# Altium project LV-PCB.PrjPCB
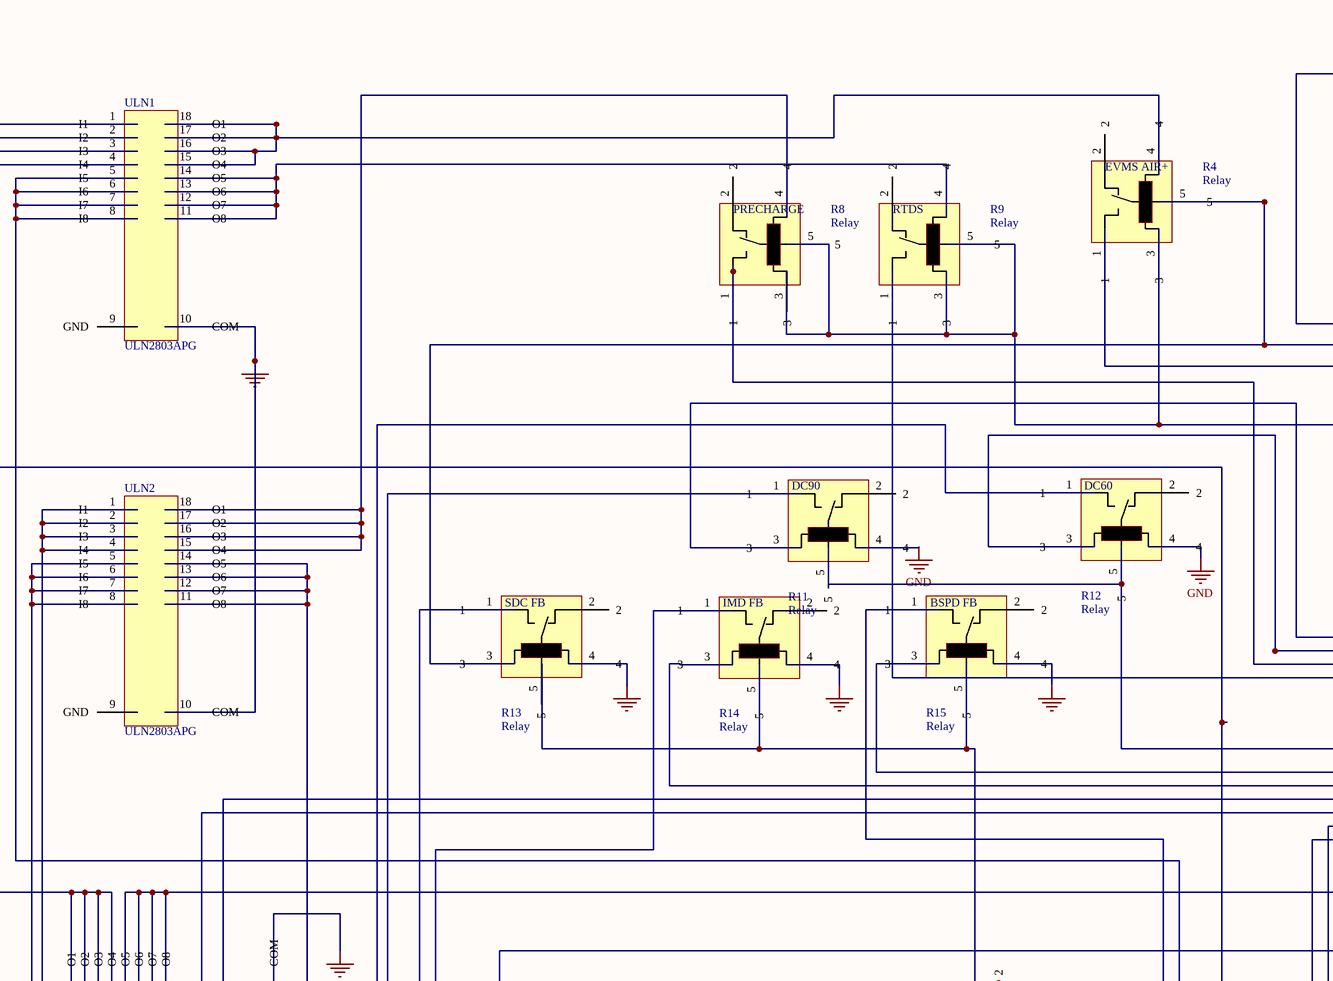
[diagram p0: Main.SchDoc, top left]
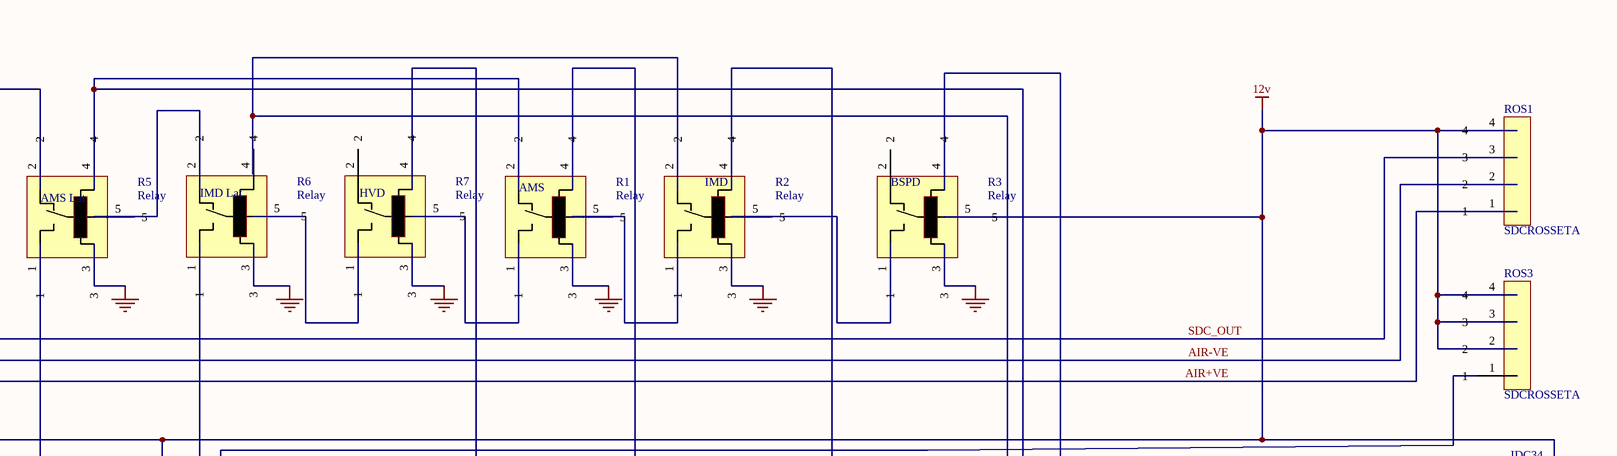
[diagram p1: Main.SchDoc, top right]
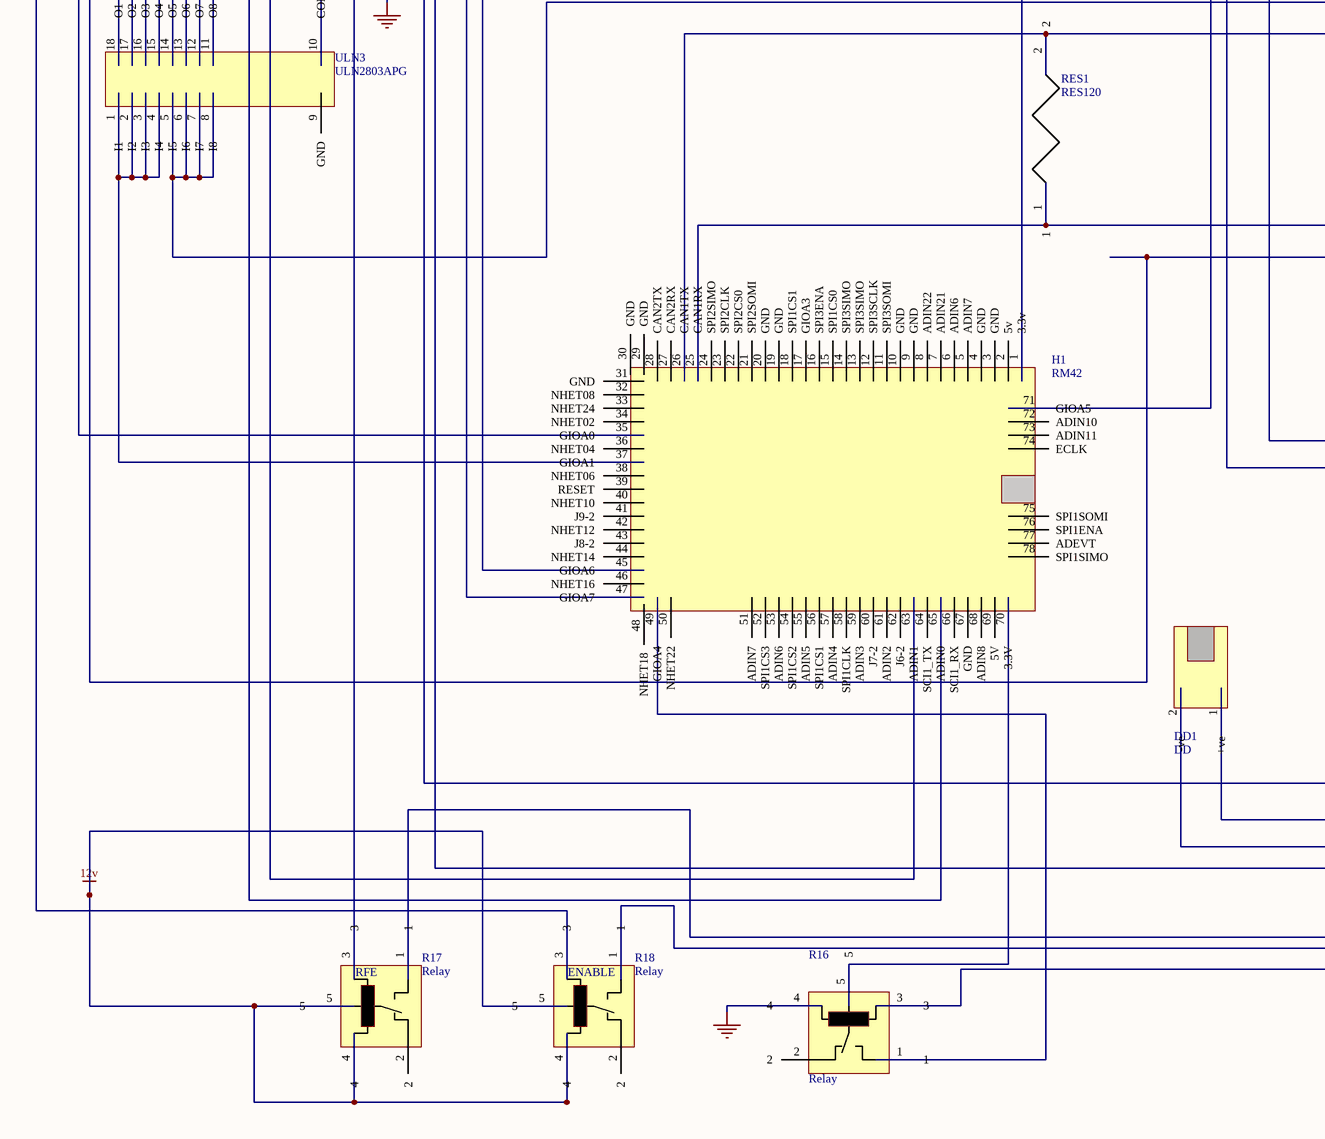
[diagram p2: Main.SchDoc, bottom left]
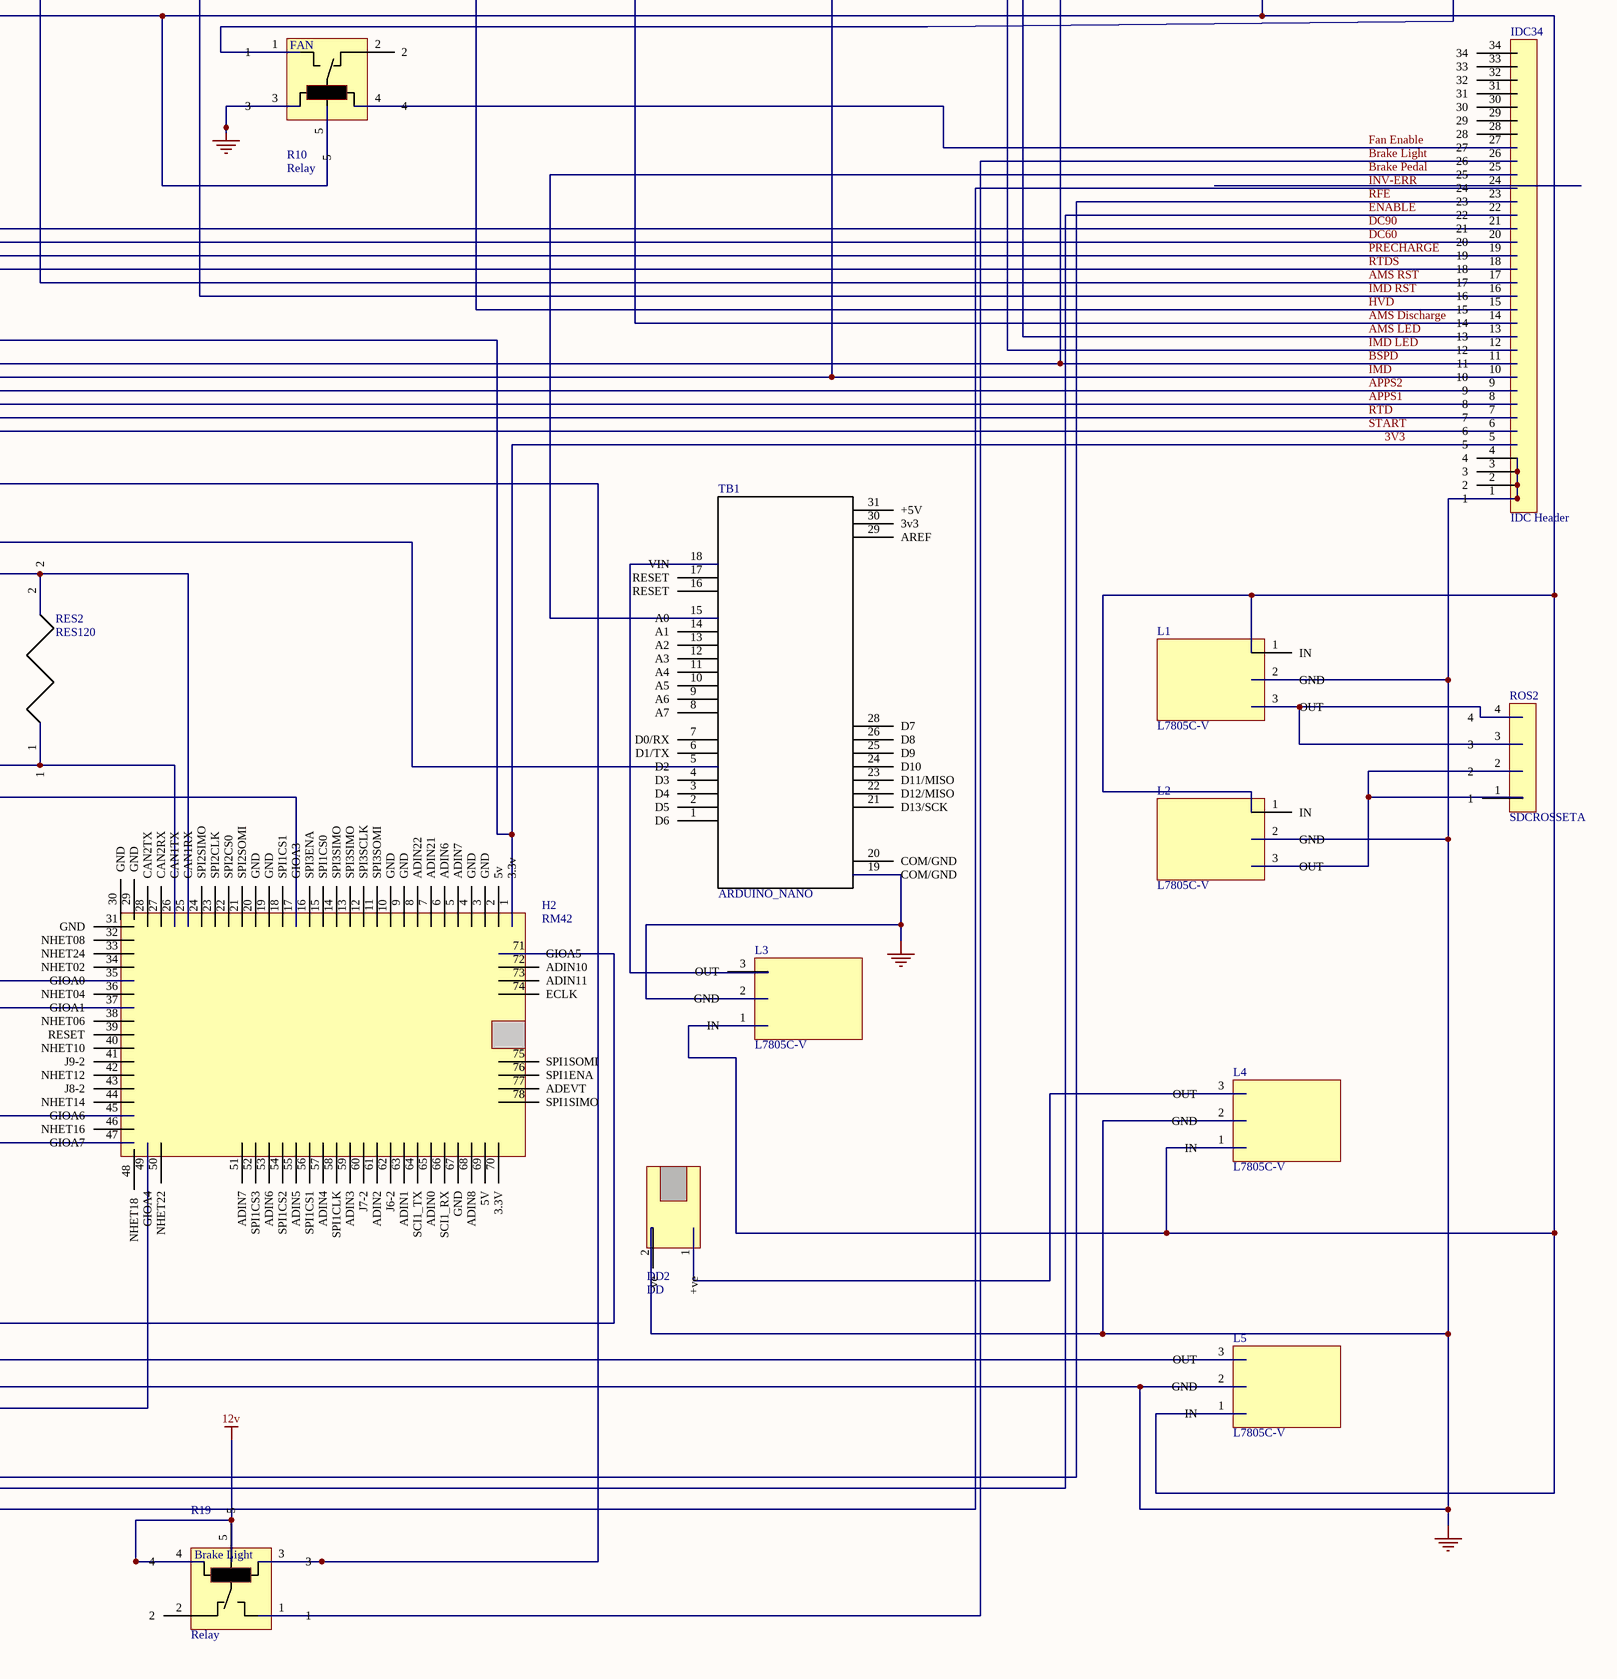
[diagram p3: Main.SchDoc, bottom right]
1 sheet, 38 parts. Net scope: global (net labels, ports and power ports of the same name join across sheets).
Board file: Main.PcbDoc

## Sheet Main.SchDoc
size A2

### Parts
DD1  DD  [DCDCBoost]
DD2  DD  [DCDCBoost]
H1  RM42  [Hercules]
H2  RM42  [Hercules]
IDC34  IDC Header  [IDC34]
L1  L7805C-V  [L7805C-P]
L2  L7805C-V  [L7805C-P]
L3  L7805C-V  [L7805C-P]
L4  L7805C-V  [L7805C-P]
L5  L7805C-V  [L7805C-P]
R1  Relay  [RelayARP03F]
R2  Relay  [RelayARP03F]
R3  Relay  [RelayARP03F]
R4  Relay  [RelayARP03F]
R5  Relay  [RelayARP03F]
R6  Relay  [RelayARP03F]
R7  Relay  [RelayARP03F]
R8  Relay  [RelayARP03F]
R9  Relay  [RelayARP03F]
R10  Relay  [RelayARP03F]
R11  Relay  [RelayARP03F]
R12  Relay  [RelayARP03F]
R13  Relay  [RelayARP03F]
R14  Relay  [RelayARP03F]
R15  Relay  [RelayARP03F]
R16  Relay  [RelayARP03F]
R17  Relay  [RelayARP03F]
R18  Relay  [RelayARP03F]
R19  Relay  [RelayARP03F]
RES1  RES120  [RES120]
RES2  RES120  [RES120]
ROS1  SDCROSSETA  [ROSSETA]
ROS2  SDCROSSETA  [ROSSETA]
ROS3  SDCROSSETA  [ROSSETA]
TB1  ARDUINO_NANO  [SHIELD_ARDUINO_NANO]
ULN1  ULN2803APG  [ULN2803APG]
ULN2  ULN2803APG  [ULN2803APG]
ULN3  ULN2803APG  [ULN2803APG]

### Nets
12v: L1.1(IN) L2.1(IN) L3.1(IN) L4.1(IN) L5.1(IN) R3.5 R4.3 R8.3 R8.5 R9.3 R9.5 R10.5 R17.4 R17.5 R18.4 R18.5 R19.4 R19.5 ROS1.4 ROS3.2 ROS3.3 ROS3.4
GND: DD1.2(-ve) DD2.2(-ve) IDC34.1 IDC34.2 IDC34.3 IDC34.4 L1.2(GND) L2.2(GND) L3.2(GND) L4.2(GND) L5.2(GND) R1.3 R2.3 R3.3 R5.3 R6.3 R7.3 R10.3 R11.4 R12.4 R13.4 R14.4 R15.4 R16.4 TB1.19(COM/GND) ULN1.10(COM) ULN2.10(COM) ULN3.10(COM)
3V3: H2.1(3.3v) IDC34.5 R11.5 R12.5
AIR+VE: R4.1 ROS1.1
AIR-VE: R4.5 R13.3 ROS1.2
AMS Discharge: IDC34.14 R1.4
AMS LED: IDC34.13 R1.2 R5.4
AMS RST: IDC34.17 R5.1
APPS1: H1.65(ADIN0) IDC34.8
APPS2: H1.63(ADIN1) IDC34.9
Brake Light: IDC34.26 R19.1
Brake Pedal: IDC34.25 TB1.15(A0)
BSPD: IDC34.11 R3.4 R15.3
DC60: IDC34.20 R12.3
DC90: IDC34.21 R11.3
ENABLE: IDC34.22 R18.1
Fan Enable: IDC34.27 R10.4
HVD: IDC34.15 R7.4
IMD: IDC34.10 R2.4 R14.3
IMD LED: IDC34.12 R2.2
IMD RST: IDC34.16 R6.1
INV-ERR: IDC34.24 R16.3
PRECHARGE: IDC34.19 R8.1
RFE: IDC34.23 R17.1
RTD: H2.47(GIOA7) IDC34.7
RTDS: IDC34.18 R9.1
SDC_OUT: R5.2 ROS1.3
START: H2.45(GIOA6) IDC34.6
NetDD1_1: DD1.1(+ve) L5.3(OUT)
NetDD2_1: DD2.1(+ve) L4.3(OUT)
NetH1_1: H1.1(3.3v) R13.5 R14.5 R15.5
NetH1_25: H1.25(CAN1RX) H2.26(CAN1TX) RES1.1 RES2.1
NetH1_26: H1.26(CAN1TX) H2.25(CAN1RX) RES1.2 RES2.2
NetH1_35: H1.35(GIOA0) ULN2.5(I5) ULN2.6(I6) ULN2.7(I7) ULN2.8(I8)
NetH1_37: H1.37(GIOA1) ULN3.1(I1) ULN3.2(I2) ULN3.3(I3) ULN3.4(I4)
NetH1_45: H1.45(GIOA6) R14.1
NetH1_47: H1.47(GIOA7) R13.1
NetH1_49: H1.49(GIOA4) R16.1
NetH1_70: H1.70(3.3V) R16.5
NetH1_71: H1.71(GIOA5) R15.1
NetH2_17: H2.17(GIOA3) ULN2.1(I1) ULN2.2(I2) ULN2.3(I3) ULN2.4(I4)
NetH2_35: H2.35(GIOA0) ULN1.1(I1) ULN1.2(I2) ULN1.3(I3) ULN1.4(I4)
NetH2_37: H2.37(GIOA1) ULN1.5(I5) ULN1.6(I6) ULN1.7(I7) ULN1.8(I8)
NetH2_49: H2.49(GIOA4) R11.1
NetH2_71: H2.71(GIOA5) R12.1
NetL1_3: L1.3(OUT) ROS2.3 ROS2.4
NetL2_3: L2.3(OUT) ROS2.1 ROS2.2
NetL3_3: L3.3(OUT) TB1.18(VIN)
NetR1_1: R1.1 R7.5
NetR1_5: R1.5 R2.1
NetR2_5: R2.5 R3.1
NetR4_4: R4.4 ULN1.15(O4) ULN1.16(O3) ULN1.17(O2) ULN1.18(O1)
NetR5_5: R5.5 R6.2
NetR6_5: R6.5 R7.1
NetR8_4: R8.4 ULN2.15(O4) ULN2.16(O3) ULN2.17(O2) ULN2.18(O1)
NetR9_4: R9.4 ULN1.11(O8) ULN1.12(O7) ULN1.13(O6) ULN1.14(O5)
NetR10_1: R10.1 ROS3.1
NetR17_3: R17.3 ULN2.11(O8) ULN2.12(O7) ULN2.13(O6) ULN2.14(O5)
NetR18_3: R18.3 ULN3.15(O4) ULN3.16(O3) ULN3.17(O2) ULN3.18(O1)
NetR19_3: R19.3 ULN3.11(O8) ULN3.12(O7) ULN3.13(O6) ULN3.14(O5)
NetTB1_5: TB1.5(D2) ULN3.5(I5) ULN3.6(I6) ULN3.7(I7) ULN3.8(I8)

Not connected (* = marked no-connect by the designer): H1 2(5v) 3(GND) 4(GND) 5(ADIN7) 6(ADIN6) 7(ADIN21) 8(ADIN22) 9(GND) 10(GND) 11(SPI3SOMI) 12(SPI3SCLK) 13(SPI3SIMO) 14(SPI3SIMO) 15(SPI1CS0) 16(SPI3ENA) 17(GIOA3) 18(SPI1CS1) 19(GND) 20(GND) 21(SPI2SOMI) 22(SPI2CS0) 23(SPI2CLK) 24(SPI2SIMO) 27(CAN2RX) 28(CAN2TX) 29(GND) 30(GND) 31(GND) 32(NHET08) 33(NHET24) 34(NHET02) 36(NHET04) 38(NHET06) 39(RESET) 40(NHET10) 41(J9-2) 42(NHET12) 43(J8-2) 44(NHET14) 46(NHET16) 48(NHET18) 50(NHET22) 51(ADIN7) 52(SPI1CS3) 53(ADIN6) 54(SPI1CS2) 55(ADIN5) 56(SPI1CS1) 57(ADIN4) 58(SPI1CLK) 59(ADIN3) 60(J7-2) 61(ADIN2) 62(J6-2) 64(SCI1_TX) 66(SCI1_RX) 67(GND) 68(ADIN8) 69(5V) 72(ADIN10) 73(ADIN11) 74(ECLK) 75(SPI1SOMI) 76(SPI1ENA) 77(ADEVT) 78(SPI1SIMO); H2 2(5v) 3(GND) 4(GND) 5(ADIN7) 6(ADIN6) 7(ADIN21) 8(ADIN22) 9(GND) 10(GND) 11(SPI3SOMI) 12(SPI3SCLK) 13(SPI3SIMO) 14(SPI3SIMO) 15(SPI1CS0) 16(SPI3ENA) 18(SPI1CS1) 19(GND) 20(GND) 21(SPI2SOMI) 22(SPI2CS0) 23(SPI2CLK) 24(SPI2SIMO) 27(CAN2RX) 28(CAN2TX) 29(GND) 30(GND) 31(GND) 32(NHET08) 33(NHET24) 34(NHET02) 36(NHET04) 38(NHET06) 39(RESET) 40(NHET10) 41(J9-2) 42(NHET12) 43(J8-2) 44(NHET14) 46(NHET16) 48(NHET18) 50(NHET22) 51(ADIN7) 52(SPI1CS3) 53(ADIN6) 54(SPI1CS2) 55(ADIN5) 56(SPI1CS1) 57(ADIN4) 58(SPI1CLK) 59(ADIN3) 60(J7-2) 61(ADIN2) 62(J6-2) 63(ADIN1) 64(SCI1_TX) 65(ADIN0) 66(SCI1_RX) 67(GND) 68(ADIN8) 69(5V) 70(3.3V) 72(ADIN10) 73(ADIN11) 74(ECLK) 75(SPI1SOMI) 76(SPI1ENA) 77(ADEVT) 78(SPI1SIMO); IDC34 28 29 30 31 32 33 34; R3 2; R4 2; R6 4; R7 2; R8 2; R9 2; R10 2; R11 2; R12 2; R13 2; R14 2; R15 2; R16 2; R17 2; R18 2; R19 2; TB1 1(D6) 2(D5) 3(D4) 4(D3) 6(D1/TX) 7(D0/RX) 8(A7) 9(A6) 10(A5) 11(A4) 12(A3) 13(A2) 14(A1) 16(RESET) 17(RESET) 20(COM/GND) 21(D13/SCK) 22(D12/MISO) 23(D11/MISO) 24(D10) 25(D9) 26(D8) 28(D7) 29(AREF) 30(3v3) 31(+5V); ULN1 9(GND); ULN2 9(GND); ULN3 9(GND)

### Notes on the sheet
- (near R4) EVMS AIR+
- (near R5) AMS Lat
- (near R6) IMD Lat
- (near R7) HVD
- (near R1) AMS
- (near R2) IMD
- (near R3) BSPD
- (near R8) PRECHARGE
- (near R9) RTDS
- (near R11) DC90
- (near R12) DC60
- (near R10) FAN
- (near R13) SDC FB
- (near R14) IMD FB
- (near R15) BSPD FB
- (near R17) RFE
- (near R18) ENABLE
- (near R19) Brake Light

### Library data of the parts
DD1 DD2 = DCDCBoost
H1 H2 = Hercules
IDC34 = IDC34
L1-L5 = L7805C-V: STMICROELECTRONICS 	   	L7805CV 	   	Linear Voltage Regulators & Vref; Max Input Voltage: 35V; Output Voltage: 5V; Max Output Current: 1.5A; Number of Outputs: 1; Polarity: Positive; Quiescent Current: 8mA; Output Type: Fixed; Dropout Voltage: 2V; Min Input Voltage: 7V; Tolerance: 5%; Power Supply Rejection Ratio (PSRR): 62dB; Supplier 1: Quest; Manufacturer: STMicroelectronics; Manufacturer Part Number: L7805C-V; Stock 1: 0; Mount: Through Hole; Case/Package: TO; Number of Pins: 3; Weight: 0.08113oz; Contact Plating: Gold; Min Operating Temperature: 0°C; Max Operating Temperature: 125°C; Packaging: Rail/Tube; Output Current: 1.5A; Package Quantity: 1000; Number of Regulators: 1; Nominal Output Voltage: 5V; Min Output Voltage: 5V; Output Configuration: Positive; Length: 10.4mm; Height: 9.15mm; Width: 4.6mm; Radiation Hardening: No; Lead Free: Lead Free; REACH SVHC: No SVHC; ComponentLink1URL: http://www.st.com/content/ccc/resource/technical/document/datasheet/41/4f/b3/b0/12/d4/47/88/CD00000444.pdf/files/CD00000444.pdf/jcr:content/translations/en.CD00000444.pdf?src-supplier=Digi-Key; ComponentLink1Description: http://www.st.com/content/ccc/resource/technical/document/datasheet/41/4f/b3/b0/12/d4/47/88/CD00000444.pdf/files/CD00000444.pdf/jcr:content/translations/en.CD00000444.pdf?src-supplier=Digi-Key; ComponentLink2URL: https://www.verical.com/server-webapp/html/getDatasheet?partID=44136&src-supplier=Verical; ComponentLink2Description: https://www.verical.com/server-webapp/html/getDatasheet?partID=44136&src-supplier=Verical; ComponentLink3URL: http://www.jameco.com/Jameco/Products/ProdDS/924633.pdf?src-supplier=Jameco; ComponentLink3Description: http://www.jameco.com/Jameco/Products/ProdDS/924633.pdf?src-supplier=Jameco; ComponentLink4URL: http://www.farnell.com/datasheets/2051023.pdf?src-supplier=Element14; ComponentLink4Description: http://www.farnell.com/datasheets/2051023.pdf?src-supplier=Element14; ComponentLink5URL: https://www.distrelec.biz/Web/Downloads/xc/_e/teL78xx-L78xxC_e.pdf?mime=application%2Fpdf&src-supplier=Distrelec; ComponentLink5Description: https://www.distrelec.biz/Web/Downloads/xc/_e/teL78xx-L78xxC_e.pdf?mime=application%2Fpdf&src-supplier=Distrelec; ComponentLink6URL: http://www.farnell.com/datasheets/2307057.pdf?src-supplier=Element14; ComponentLink6Description: http://www.farnell.com/datasheets/2307057.pdf?src-supplier=Element14; ComponentLink7URL: http://www.rapidonline.com/pdf/47-3290e.pdf?src-supplier=Rapid+Electronics; ComponentLink7Description: http://www.rapidonline.com/pdf/47-3290e.pdf?src-supplier=Rapid+Electronics; ComponentLink8URL: http://www.farnell.com/datasheets/1805459.pdf?src-supplier=Element14; ComponentLink8Description: http://www.farnell.com/datasheets/1805459.pdf?src-supplier=Element14; ComponentLink9URL: http://www.st.com/web/en/resource/technical/document/datasheet/CD00000444.pdf?src-supplier=Digi-Key; ComponentLink9Description: http://www.st.com/web/en/resource/technical/document/datasheet/CD00000444.pdf?src-supplier=Digi-Key; ComponentLink10URL: http://www.farnell.com/datasheets/1805459.pdf?src-supplier=Newark; ComponentLink10Description: http://www.farnell.com/datasheets/1805459.pdf?src-supplier=Newark; ComponentLink11URL: http://www.st.com/web/en/resource/technical/document/datasheet/CD00000444.pdf?src-supplier=Future+Electronics; ComponentLink11Description: http://www.st.com/web/en/resource/technical/document/datasheet/CD00000444.pdf?src-supplier=Future+Electronics; ComponentLink12URL: http://www.produktinfo.conrad.com/datenblaetter/150000-174999/156048-da-01-en-SPANNUNGSREGLER_L_7805_CV__TO220__STM.pdf?src-supplier=Conrad; ComponentLink12Description: http://www.produktinfo.conrad.com/datenblaetter/150000-174999/156048-da-01-en-SPANNUNGSREGLER_L_7805_CV__TO220__STM.pdf?src-supplier=Conrad; ComponentLink13URL: http://datasheet.iiic.cc/stmicroelectronics/L7805CV.pdf?src-supplier=IIIC; ComponentLink13Description: http://datasheet.iiic.cc/stmicroelectronics/L7805CV.pdf?src-supplier=IIIC; Supplier Part Number 1: L7805CV
R1-R19 = RelayARP03F: Max 12A switching capability / 1 form A and 1 form C contact arrangement / Coil voltage: 3~48VDC / Contact capacity: 10A  28VDC / 240VAC / Outline size: 19×15.5×15.5 (mm); Coil Voltage: 3-48v; Category: Relays; Max Switching Current: 12A
RES1 RES2 = RES120: Carbon Resistor 120.0 ohm 1/4W
TB1 = ARDUINO_NANO: Dev.kit: Arduino; UART; ICSP, USB B mini, pin strips; MP: ARDUINO NANO; SnapEDA_Link: https://www.snapeda.com/parts/ARDUINO%20NANO/Arduino/view-part/?ref=snap; Price: None; Availability: Unavailable; MF: Arduino; Package: None; Value: *